# Altium schematic sheet SensorLDR.SchDoc
size A
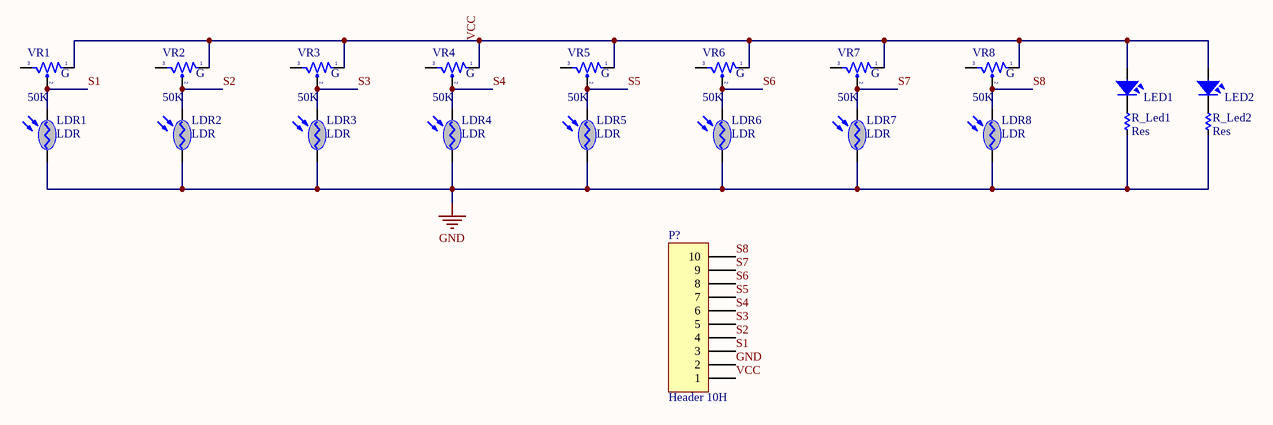
[diagram p0: SensorLDR.SchDoc]

## Parts
LDR1  LDR  [CDS]
LDR2  LDR  [CDS]
LDR3  LDR  [CDS]
LDR4  LDR  [CDS]
LDR5  LDR  [CDS]
LDR6  LDR  [CDS]
LDR7  LDR  [CDS]
LDR8  LDR  [CDS]
LED1  LED  [LED-3MM-YELLOW]  (value not drawn)
LED2  LED  [LED-3MM-YELLOW]  (value not drawn)
P?  Header 10H  [HDR1X10H]
R_Led1  Res  [RES-1/2W]
R_Led2  Res  [RES-1/2W]
VR1  50K  [VR-S2]
VR2  50K  [VR-S2]
VR3  50K  [VR-S2]
VR4  50K  [VR-S2]
VR5  50K  [VR-S2]
VR6  50K  [VR-S2]
VR7  50K  [VR-S2]
VR8  50K  [VR-S2]

## Nets
GND: LDR1.1(A) LDR2.1(A) LDR3.1(A) LDR4.1(A) LDR5.1(A) LDR6.1(A) LDR7.1(A) LDR8.1(A) P?.2 R_Led1.2 R_Led2.2
S1: LDR1.2(K) P?.3 VR1.2
S2: LDR2.2(K) P?.4 VR2.2
S3: LDR3.2(K) P?.5 VR3.2
S4: LDR4.2(K) P?.6 VR4.2
S5: LDR5.2(K) P?.7 VR5.2
S6: LDR6.2(K) P?.8 VR6.2
S7: LDR7.2(K) P?.9 VR7.2
S8: LDR8.2(K) P?.10 VR8.2
VCC: LED1.1 LED2.1 P?.1 VR1.1 VR2.1 VR3.1 VR4.1 VR5.1 VR6.1 VR7.1 VR8.1
NetLED1_2: LED1.2 R_Led1.1
NetLED2_2: LED2.2 R_Led2.1

Not connected (* = marked no-connect by the designer): VR1 3; VR2 3; VR3 3; VR4 3; VR5 3; VR6 3; VR7 3; VR8 3

## Notes on the sheet
- (in symbol VR-S) G

## Library data of the parts
LDR1-LDR8 = LDR: Quang Tro
LED1 LED2 = LED: LED Single colour Green and Red; Value: LED 3 ly Single Colour
P? = Header 10H: Header, 10-Pin, Right Angle; LatestRevisionDate: 17-Jul-2002; LatestRevisionNote: Re-released for DXP Platform.; Publisher: Altium Limited
R_Led1 R_Led2 = Res: Manufacturer: Generic Components; Class: Passive; SubClass: R; Published: 08/06/2000; Publisher: Altium Hobart Technology Centre
VR1-VR8 = VR-S: Var Resistor; Value: Volume 50k